# EAGLE design MAX86141_HEG_MINI (EAGLE 9.5.1)
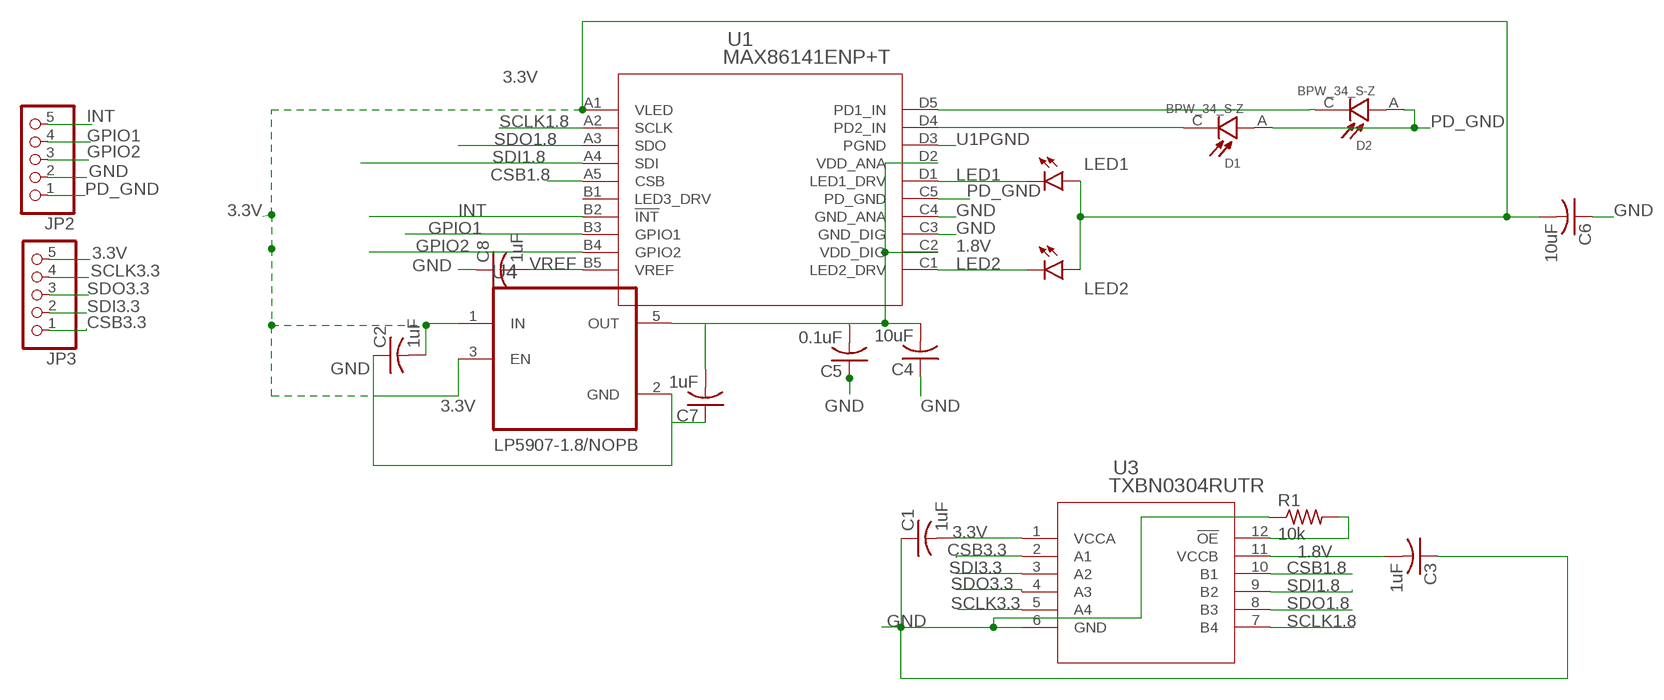
[diagram p0: schematic, sheet 1]

## Parts
C1  1uF  C-USC0402  [C0402]
C2  1uF  C-USC0402  [C0402]
C3  1uF  C-USC0402  [C0402]
C4  10uF  C-USC0402  [C0402]
C5  0.1uF  C-USC0402  [C0402]
C6  10uF  C-USC0402  [C0402]
C7  1uF  C-USC0402  [C0402]
C8  1uF  C-USC0402  [C0402]
D1  BPW_34_S-Z  [DIO_BPW_34_S-Z]
D2  BPW_34_S-Z  [DIO_BPW_34_S-Z]
JP2  PINHD-1X5  [1X05]
JP3  PINHD-1X5  [1X05]
LED1  LEDCHIPLED_1206  [CHIPLED_1206]
LED2  LEDCHIPLED_1206  [CHIPLED_1206]
R1  10k  R-US_R0402  [R0402]
U1  MAX86141ENP+T  [21-100134A_20]
U3  TXBN0304RUTR  [RUT12]
U4  LP5907MFX-3.3/NOPB  [SOT95P280X145-5N]

## Nets
1.8V: C3.2 C4.2 C5.2 C7.2 U1.C2(VDD_DIG) U1.D2(VDD_ANA) U3.11(VCCB) U4.5(OUT)
3.3V: C1.2 C2.2 C6.2 JP3.5 LED1.A LED2.A U1.A1(VLED) U3.1(VCCA) U4.1(IN) U4.3(EN)
CSB1.8: U1.A5(CSB) U3.10(B1)
CSB3.3: JP3.1 U3.2(A1)
GND: C1.1 C2.1 C3.1 C4.1 C5.1 C6.1 C7.1 C8.1 JP2.2 R1.1 U1.C3(GND_DIG) U1.C4(GND_ANA) U3.6(GND) U4.2(GND)
GPIO1: JP2.4 U1.B3(GPIO1)
GPIO2: JP2.3 U1.B4(GPIO2)
INT: JP2.5 U1.B2(!INT)
LED1: LED1.C U1.D1(LED1_DRV)
LED2: LED2.C U1.C1(LED2_DRV)
OE: R1.2 U3.12(!OE)
PD1_IN: D2.C U1.D5(PD1_IN)
PD2_IN: D1.C U1.D4(PD2_IN)
PD_GND: D1.A D2.A JP2.1 U1.C5(PD_GND)
SCLK1.8: U1.A2(SCLK) U3.7(B4)
SCLK3.3: JP3.4 U3.5(A4)
SDI1.8: U1.A4(SDI) U3.9(B2)
SDI3.3: JP3.2 U3.3(A2)
SDO1.8: U1.A3(SDO) U3.8(B3)
SDO3.3: JP3.3 U3.4(A3)
U1PGND: U1.D3(PGND)
VREF: C8.2 U1.B5(VREF)
Unconnected: U1.B1(LED3_DRV)

## Notes on the sheet
- LP5907-1.8/NOPB

## Library data of the parts
C1-C8 = adafruit:C-US: CAPACITOR, American symbol
D1 D2 = BPW_34_S-Z:BPW_34_S-Z: Silicon PIN Photodiode; DESCRIPTION: Photodiode 850nm 20ns 120° 2-SMD, Gull Wing; DIGI-KEY_PART_NUMBER: 475-2659-1-ND; DIGI-KEY_PURCHASE_URL: https://www.digikey.com/product-detail/en/osram-opto-semiconductors-inc/BPW-34-S-Z/475-2659-1-ND/1893861?utm_source=snapeda&utm_medium=aggregator&utm_campaign=symbol; MF: OSRAM Opto; MP: BPW 34 S-Z; PACKAGE: SMD-2 OSRAM Opto
JP2 JP3 = pinhead:PINHD-1X5: PIN HEADER
LED1 LED2 = led:LED: LED OSRAM: - CHIPLED LG R971, LG N971, LY N971, LG Q971, LY Q971, LO R971, LY R971 LH N974, LH R974 LS Q976, LO Q976, LY Q976 LO Q996 - Hyper CHIPLED LW Q18S LB Q993, LB Q99A, LB R99A - SideLED LS A670, LO A670, LY A670, LG A670, LP A670 LB A673, LV A673, LT A673, LW A673 LH A674 LY A675 LS A676, LA A676, LO A676, LY A676, LW A676 LS A679, LY A679, LG A679 - Hyper Micro SIDELED® LS Y876, LA Y876, LO Y876, LY Y876 LT Y87S - SmartLED LW L88C, LW L88S LB L89C, LB L89S, LG L890 LS L89K, LO L89K, LY L89K LS L896, LA L896, LO L896, LY L896 - TOPLED LS T670, LO T670, LY T670, LG T670, LP T670 LSG T670, LSP T670, LSY T670, LOP T670, LYG T670 LG T671, LOG T671, LSG T671 LB T673, LV T673, LT T673, LW T673 LH T674 LS T676, LA T676, LO T676, LY T676, LB T676, LH T676, LSB T676, LW T676 LB T67C, LV T67C, LT T67C, LS T67K, LO T67K, LY T67K, LW E67C LS E67B, LA E67B, LO E67B, LY E67B, LB E67C, LV E67C, LT E67C LW T67C LS T679, LY T679, LG T679 LS T770, LO T770, LY T770, LG T770, LP T770 LB T773, LV T773, LT T773, LW T773 LH T774 LS E675, LA E675, LY E675, LS T675 LS T776, LA T776, LO T776, LY T776, LB T776 LHGB T686 LT T68C, LB T68C - Hyper Mini TOPLED® LB M676 - Mini TOPLED Santana® LG M470 LS M47K, LO M47K, LY M47K Source: http://www.osram.convergy.de LUXEON: - LUMILED® LXK2-PW12-R00, LXK2-PW12-S00, LXK2-PW14-U00, LXK2-PW14-V00 LXK2-PM12-R00, LXK2-PM12-S00, LXK2-PM14-U00 LXK2-PE12-Q00, LXK2-PE12-R00, LXK2-PE12-S00, LXK2-PE14-T00, LXK2-PE14-U00 LXK2-PB12-K00, LXK2-PB12-L00, LXK2-PB12-M00, LXK2-PB14-N00, LXK2-PB14-P00, LXK2-PB14-Q00 LXK2-PR12-L00, LXK2-PR12-M00, LXK2-PR14-Q00, LXK2-PR14-R00 LXK2-PD12-Q00, LXK2-PD12-R00, LXK2-PD12-S00 LXK2-PH12-R00, LXK2-PH12-S00 LXK2-PL12-P00, LXK2-PL12-Q00, LXK2-PL12-R00 Source: www.luxeon.com KINGBRIGHT: KA-3528ASYC Source: www.kingbright.com
R1 = adafruit:R-US_: RESISTOR, American symbol
U1 = MAX86141:MAX86141ENP+T; MANUFACTURER_PART_NUMBER: MAX86141ENP+T; VENDOR: Maxim Integrated Products
U3 = TXBN0304:TXBN0304RUTR; BUILT_BY: EMA_UL_Team; MANUFACTURER_PART_NUMBER: TXBN0304RUTR; VENDOR: Texas Instruments
U4 = LP5907MFX-3.3_NOPB:LP5907MFX-3.3/NOPB: IC REG LINEAR 3.3V 250MA SOT23; AVAILABILITY: Unavailable; DESCRIPTION: Linear Voltage Regulator IC 1 Output 250mA SOT-23-5; MF: Texas Instruments; MP: LP5907MFX-3.3/NOPB; PACKAGE: SOT-23 Texas Instruments; PRICE: None

## Board
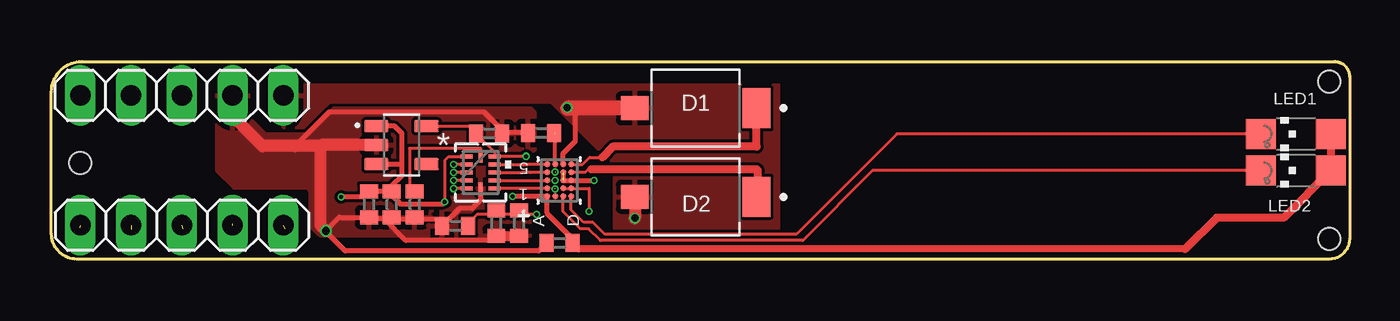
[diagram p1: board, top side]
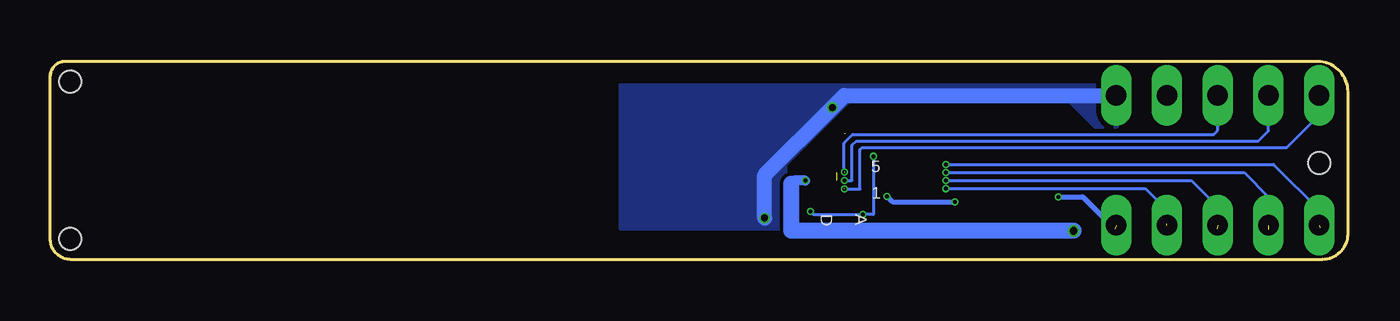
[diagram p2: board, bottom side, seen from below]

Size 65 x 9.91 mm. Coordinates in mm from the lower left corner, seen from the top.
Outline: 1.52,9.91 64.24,9.91 arc-90 65,9.14 65,1.02 arc-90 63.98,0 1.27,0 arc-90 0,1.27 0,8.38 arc-90 1.52,9.91
Copper layers (1*16): Top 0.035mm / dielectric 1.5mm / Bottom 0.035mm
Design rules "default *": minimum track width 6mil, minimum drill 0.35mm, track to track 6mil, track to pad 6mil, pad to pad 6mil, via to via 2mil, smd to smd 6mil, copper to edge 40mil, drill to drill 6mil, minimum pad ring 10mil, minimum via ring 3mil, stop-mask expansion 4mil, vias tented up to drill 0mil, thermal gap 10mil
Holes 1.1 mm at 1.45,4.83 63.98,1.02 63.98,8.89

### Footprints (pad centres in the part's own frame; a part is rotated, then mirrored left to right if it is on the bottom)
C0402 = smd 0.7 x 0.9: 1 -0.65,0; 2 0.65,0
DIO_BPW_34_S-Z = smd 1.4 x 1.2: A -3.05,0 | smd 1.4 x 2: C 3.05,0
1X05 = drill 1.016 long: 1 -5.08,0; 2 -2.54,0; 3 0,0; 4 2.54,0; 5 5.08,0
CHIPLED_1206 = smd 1.5 x 1.5: A 0,-1.75; C 0,1.75
R0402 = smd 0.7 x 0.9: 1 -0.65,0; 2 0.65,0
21-100134A_20 = smd 0.305 x 0.305: A1 -0.8,0.6; A2 -0.4,0.6; A3 0,0.6; A4 0.4,0.6; A5 0.8,0.6; B1 -0.8,0.2; B2 -0.4,0.2; B3 0,0.2; B4 0.4,0.2; B5 0.8,0.2; C1 -0.8,-0.2; C2 -0.4,-0.2; C3 0,-0.2; C4 0.4,-0.2; C5 0.8,-0.2; D1 -0.8,-0.6; D2 -0.4,-0.6; D3 0,-0.6; D4 0.4,-0.6; D5 0.8,-0.6
RUT12 = smd 0.6 x 0.2: 1 -0.7,0.8; 2 -0.7,0.4; 3 -0.7,0; 4 -0.7,-0.4; 5 -0.7,-0.8; 7 0.7,-0.8; 8 0.7,-0.4; 9 0.7,0; 10 0.7,0.4; 11 0.7,0.8 | smd 0.2 x 0.6: 6 0,-0.8; 12 0,0.8
SOT95P280X145-5N = smd 1.21 x 0.59: 1 -1.255,0.95; 2 -1.255,0; 3 -1.255,-0.95; 4 1.255,-0.95; 5 1.255,0.95

### Placement (x,y rotation side)
C1  15.9,2.74 90 top
C2  17.04,2.74 90 top
C3  20.22,1.68 0 top
C4  22.28,1.8 90 top
C5  23.42,1.8 90 top
C6  25.45,0.81 0 top
C7  21.92,6.3 180 top
C8  24.51,6.32 0 top
D1  32.26,3.12 0 top
D2  32.26,7.57 0 top
JP2  6.53,8.2 180 top
JP3  6.53,1.7 0 top
LED1  62.31,6.28 90 top
LED2  62.31,4.44 90 top
R1  18.19,2.74 90 top
U1  25.43,3.94 90 top
U3  21.49,4.34 0 top
U4  17.53,5.71 0 top

### Tracks (layer width: path | path; a pad name or v marks a point on that pad's centre or on a via)
1.8V  (via drill 0.2)
  Top 0.152: U1.C2 U1.D2 26.92,3.54 v26.92,2.39 | v23.77,5.16 23.76,5.14 U3.11 22.19,5.37 21.25,6.3 | C3.2 20.87,1.79 21.31,2.23 22.3,2.23 | v24.28,2.23 23.24,2.23 | 23.24,2.23 22.3,2.23 | 21.25,6.3 20.89,6.67 U4.5 | C7.2 21.25,6.3 | C5.2 23.24,2.28 23.24,2.23 | C4.2 22.28,2.26 22.3,2.23
  Bottom 0.152: v26.92,2.39 26.77,2.23 v24.28,2.23 23.77,2.23 v23.77,5.16
3.3V  (via drill 0.2)  (1 unrouted)
  Top 0.152: v19.7,2.87 19.7,4.95 19.89,5.14 U3.1 | U4.3 | 64.06,4.78 LED2.A | 17.04,3.67 C2.2 17.09,3.34 17.09,3.16 | C1.2 15.63,3.12 | v23.09,3.14 v23.09,3.15
  Top 0.254: v19.7,2.87 19.57,2.74 17.52,2.74 17.09,3.16 | C6.2 26.1,1.02 24.83,2.29 U1.A1 v23.09,3.14 | 17.04,3.67 17.55,4.18 17.55,4.76 | 17.55,4.76 17.55,6.3 17.19,6.67 U4.1 | C2.2 C1.2 | 15.63,3.12 v14.5,3.12 | U4.3 17.55,4.76
  Top 0.356: 56.77,0.51 26.41,0.51 C6.2
  Top 0.406: LED1.A 64.06,4.78 | LED2.A 61.7,2.08 58.34,2.08 56.77,0.51
  Bottom 0.254: v23.09,3.15 22.81,2.87 v19.7,2.87 | v14.5,3.12 13.28,3.12 11.68,1.52
CSB1.8
  Top 0.152: U1.A5 23.85,4.75 23.85,4.74 U3.10
CSB3.3  (via drill 0.2)  (1 unrouted)
  Top 0.152: U3.2 v20.14,4.74 v20.14,4.75
  Bottom 0.152: 1.42,1.57 1.42,2.44 3.73,4.75 v20.14,4.75
GND  (via drill 0.2, 0.4)  (1 unrouted)
  Top 0.152: C8.1 23.84,6.35 | 22.58,6.35 22.57,6.36 | C3.1 19.26,1.98 | 16.67,2.01 16.7,1.98 16.99,1.98 16.99,1.99 17.04,2.04 C2.1 | 16.01,2.01 15.93,2.09 C1.1 | 22.28,0.94 C4.1 22.29,1.17 | C7.1 22.57,6.36 | 22.57,6.36 22.57,6.46 | U4.2 15.85,5.71 | 23.4,1.17 C5.1 | R1.1 18.19,2.06 18.11,1.98 | v13.74,1.42 13.74,1.37
  Top 0.254: 23.84,6.35 22.58,6.35 | 22.57,6.46 21.65,7.38 13.9,7.38 12.19,5.66 | v27.18,3.94 U1.C3 U1.C4 | U3.6 21.49,2.96 21.07,2.54 20.43,2.54 C3.1 | 19.26,1.98 18.11,1.98 16.99,1.98 | 16.67,2.01 16.01,2.01 | 16.7,1.98 17.74,0.94 22.28,0.94 | C1.1 14.41,2.09 v13.74,1.42 | C6.1 24.39,0.41 14.71,0.41 13.74,1.37
  Top 0.508: C4.1 22.28,1.09 | 22.29,1.17 23.4,1.17
  Top 0.61: U4.2 13.49,5.71 13.49,5.66 | 13.49,5.66 12.19,5.66 10.57,5.66 9.07,7.16 JP2.2 | v13.74,1.42 13.49,1.68 13.49,5.66
  Bottom 0.508: 27.89,3.79 27.74,3.94 v27.18,3.94
  Bottom 0.813: 27.89,3.79 27.89,1.42 v13.74,1.42
  pour Top: 9.91,9.91 8.26,9.91 8.26,4.42 9.12,3.56 12.8,3.56 12.93,3.43 12.93,1.65 13.82,0.76 23.98,0.76 23.98,5.21 24.23,5.46 24.23,7.37 24.03,7.57 14.1,7.57 12.8,6.27 10.74,6.27 9.91,7.11
GPIO1  (via drill 0.2)
  Bottom 0.152: JP2.4 3.99,6.43 4.5,5.92 24.63,5.92 24.83,5.71 24.83,3.94 U1.B3
  other vias: 25.23,3.94
GPIO2  (via drill 0.2)  (1 unrouted)
  Bottom 0.152: v25.23,4.36 v25.23,4.37 25.23,5.82 24.8,6.25 6.73,6.25 6.53,6.45 JP2.3
INT  (via drill 0.2)  (1 unrouted)
  Bottom 0.152: v25.23,3.52 25.21,3.5 24.43,3.5 24.43,5.49 24.33,5.59 3.07,5.59 2.08,6.58 1.5,7.16 1.45,7.21 JP2.5
LED1
  Top 0.152: 60.23,6.28 LED1.C 42.33,6.28 37.32,1.27 27.69,1.27 27.11,1.84 26.64,1.84 26.03,2.46 U1.D1
LED2
  Top 0.152: 60.3,4.44 LED2.C 41.12,4.44 37.62,0.94 27.48,0.94 26.9,1.52 26.49,1.52 25.63,2.39 U1.C1
OE
  Top 0.152: R1.2 17.92,3.66 17.92,5.56 21.49,5.56 U3.12
PD1_IN
  Top 0.152: U1.D5 26.58,4.74 26.94,5.1 27.58,5.1
  Top 0.406: 27.58,5.1 28.12,5.64 35.31,5.64 D2.C
PD2_IN
  Top 0.152: U1.D4 26.72,4.35 26.87,4.5 27.02,4.5
  Top 0.406: D1.C 35.36,3.17 35.36,4.44 35.31,4.5 27.02,4.5
PD_GND  (via drill 0.35)
  Top 0.254: U1.C5 25.63,5.3 26.24,5.92 26.24,7.19 25.86,7.57
  Top 0.61: D1.A v29.21,2.06 | 25.86,7.57 v25.82,7.61
  Top 0.762: D2.A 25.86,7.57
  Bottom 0.762: v29.21,2.06 29.21,4.22 v25.82,7.61 25.22,8.2 JP2.1
  pour Top: 28.17,1.5 36.42,1.5 36.42,9.93 11.58,9.93 11.58,6.6 12.67,6.6 13.94,7.87 24.99,7.87 28.17,4.7
  pour Bottom: 28.17,1.5 36.42,1.5 36.42,9.93 11.58,9.93 11.58,6.6 12.67,6.6 13.94,7.87 24.99,7.87 28.17,4.7
SCLK1.8
  Top 0.152: U1.A2 22.78,3.54 U3.7 22.17,3.53 U3.7
SCLK3.3  (via drill 0.2)  (1 unrouted)
  Top 0.152: U3.5 20.78,3.53 v20.14,3.53
  Bottom 0.152: v20.14,3.53 10.16,3.53 9.07,2.44 9.07,1.78
SDI1.8
  Top 0.152: U1.A4 23.96,4.35 | 23.96,4.35 23.96,4.34 | 23.96,4.35 23.58,4.35 23.58,4.34 U3.9
SDI3.3  (via drill 0.2)  (1 unrouted)
  Top 0.152: U3.3 v20.14,4.34
  Bottom 0.152: 3.99,1.5 3.99,3.12 5.21,4.34 v20.14,4.34
SDO1.8
  Top 0.152: U1.A3 24.8,3.92 23.88,3.92 | 23.88,3.92 | 23.88,3.92 22.21,3.92 U3.8
SDO3.3  (via drill 0.2)  (1 unrouted)
  Top 0.152: U3.4 v20.14,3.94
  Bottom 0.152: v20.14,3.94 7.85,3.94 6.58,2.67 6.58,1.52
VREF  (1 unrouted)
  Top 0.203: U1.B5 25.23,6.3

### Text on the board
tValuesAlt: C7 | C8 | LED1 | INT | GPIO1 | GPIO2 | GND | PD_GND | P1 | MAX86141 HEG MINI Prototype (MIT License) / Designed By: Joshua Brewster | U2 | U3 | cathode | SS | MOSI | MISO | SCK | VDD | LED2 | U1 | P2 | C1 | C2 | R1 | C3 | C4 | C5 | C6